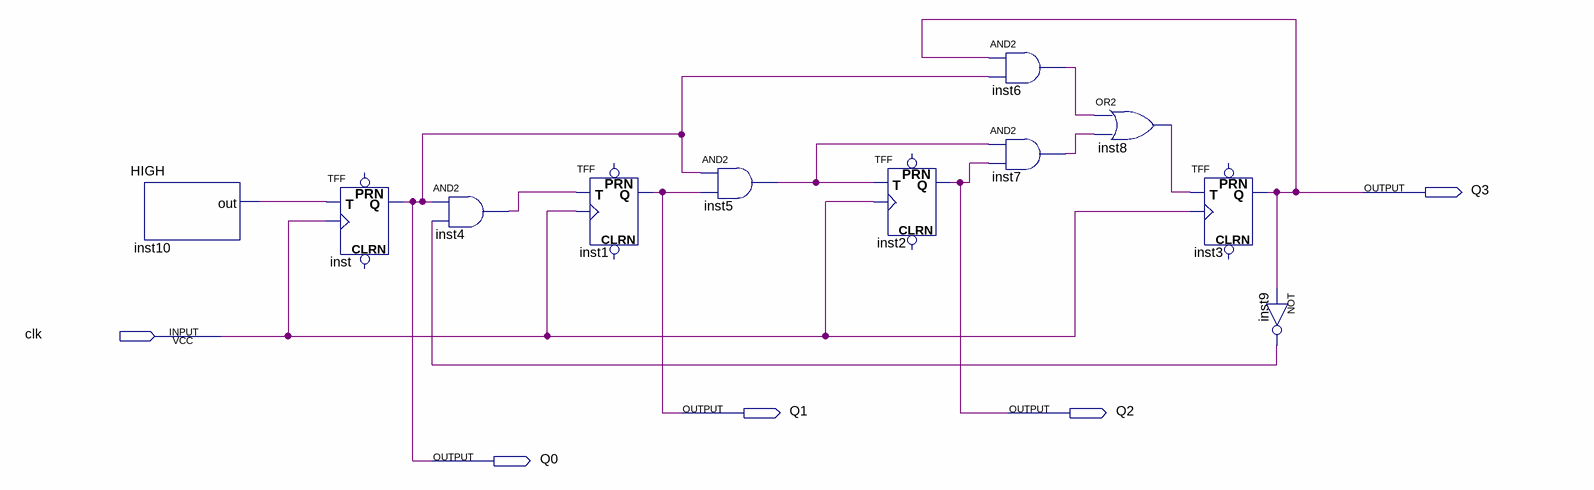
[diagram p0: schematic sheet]
// Quartus schematic decade_counter.bdf as structural Verilog: 11 symbols, 5 pins
module decade_counter (
  input  clk,
  output Q3,
  output Q1,
  output Q2,
  output Q0
);

  wire inst4_out, inst5_out, inst6_out, inst7_out, inst8_out, inst9_out, inst10_out;

  HIGH inst10 (.out(inst10_out));
  TFF inst (.T(inst10_out), .CLK(clk), .Q(Q0));  // open: PRN, CLRN
  and inst4 (inst4_out, Q0, inst9_out);
  TFF inst1 (.T(inst4_out), .CLK(clk), .Q(Q1));  // open: PRN, CLRN
  and inst5 (inst5_out, Q0, Q1);
  TFF inst2 (.T(inst5_out), .CLK(clk), .Q(Q2));  // open: PRN, CLRN
  and inst6 (inst6_out, Q3, Q0);
  and inst7 (inst7_out, inst5_out, Q2);
  or inst8 (inst8_out, inst6_out, inst7_out);
  TFF inst3 (.T(inst8_out), .CLK(clk), .Q(Q3));  // open: PRN, CLRN
  not inst9 (inst9_out, Q3);
endmodule
